# EasyEDA Pro project ProPrj_数控直流电源v3_2025-11-28.epro, board PCB2
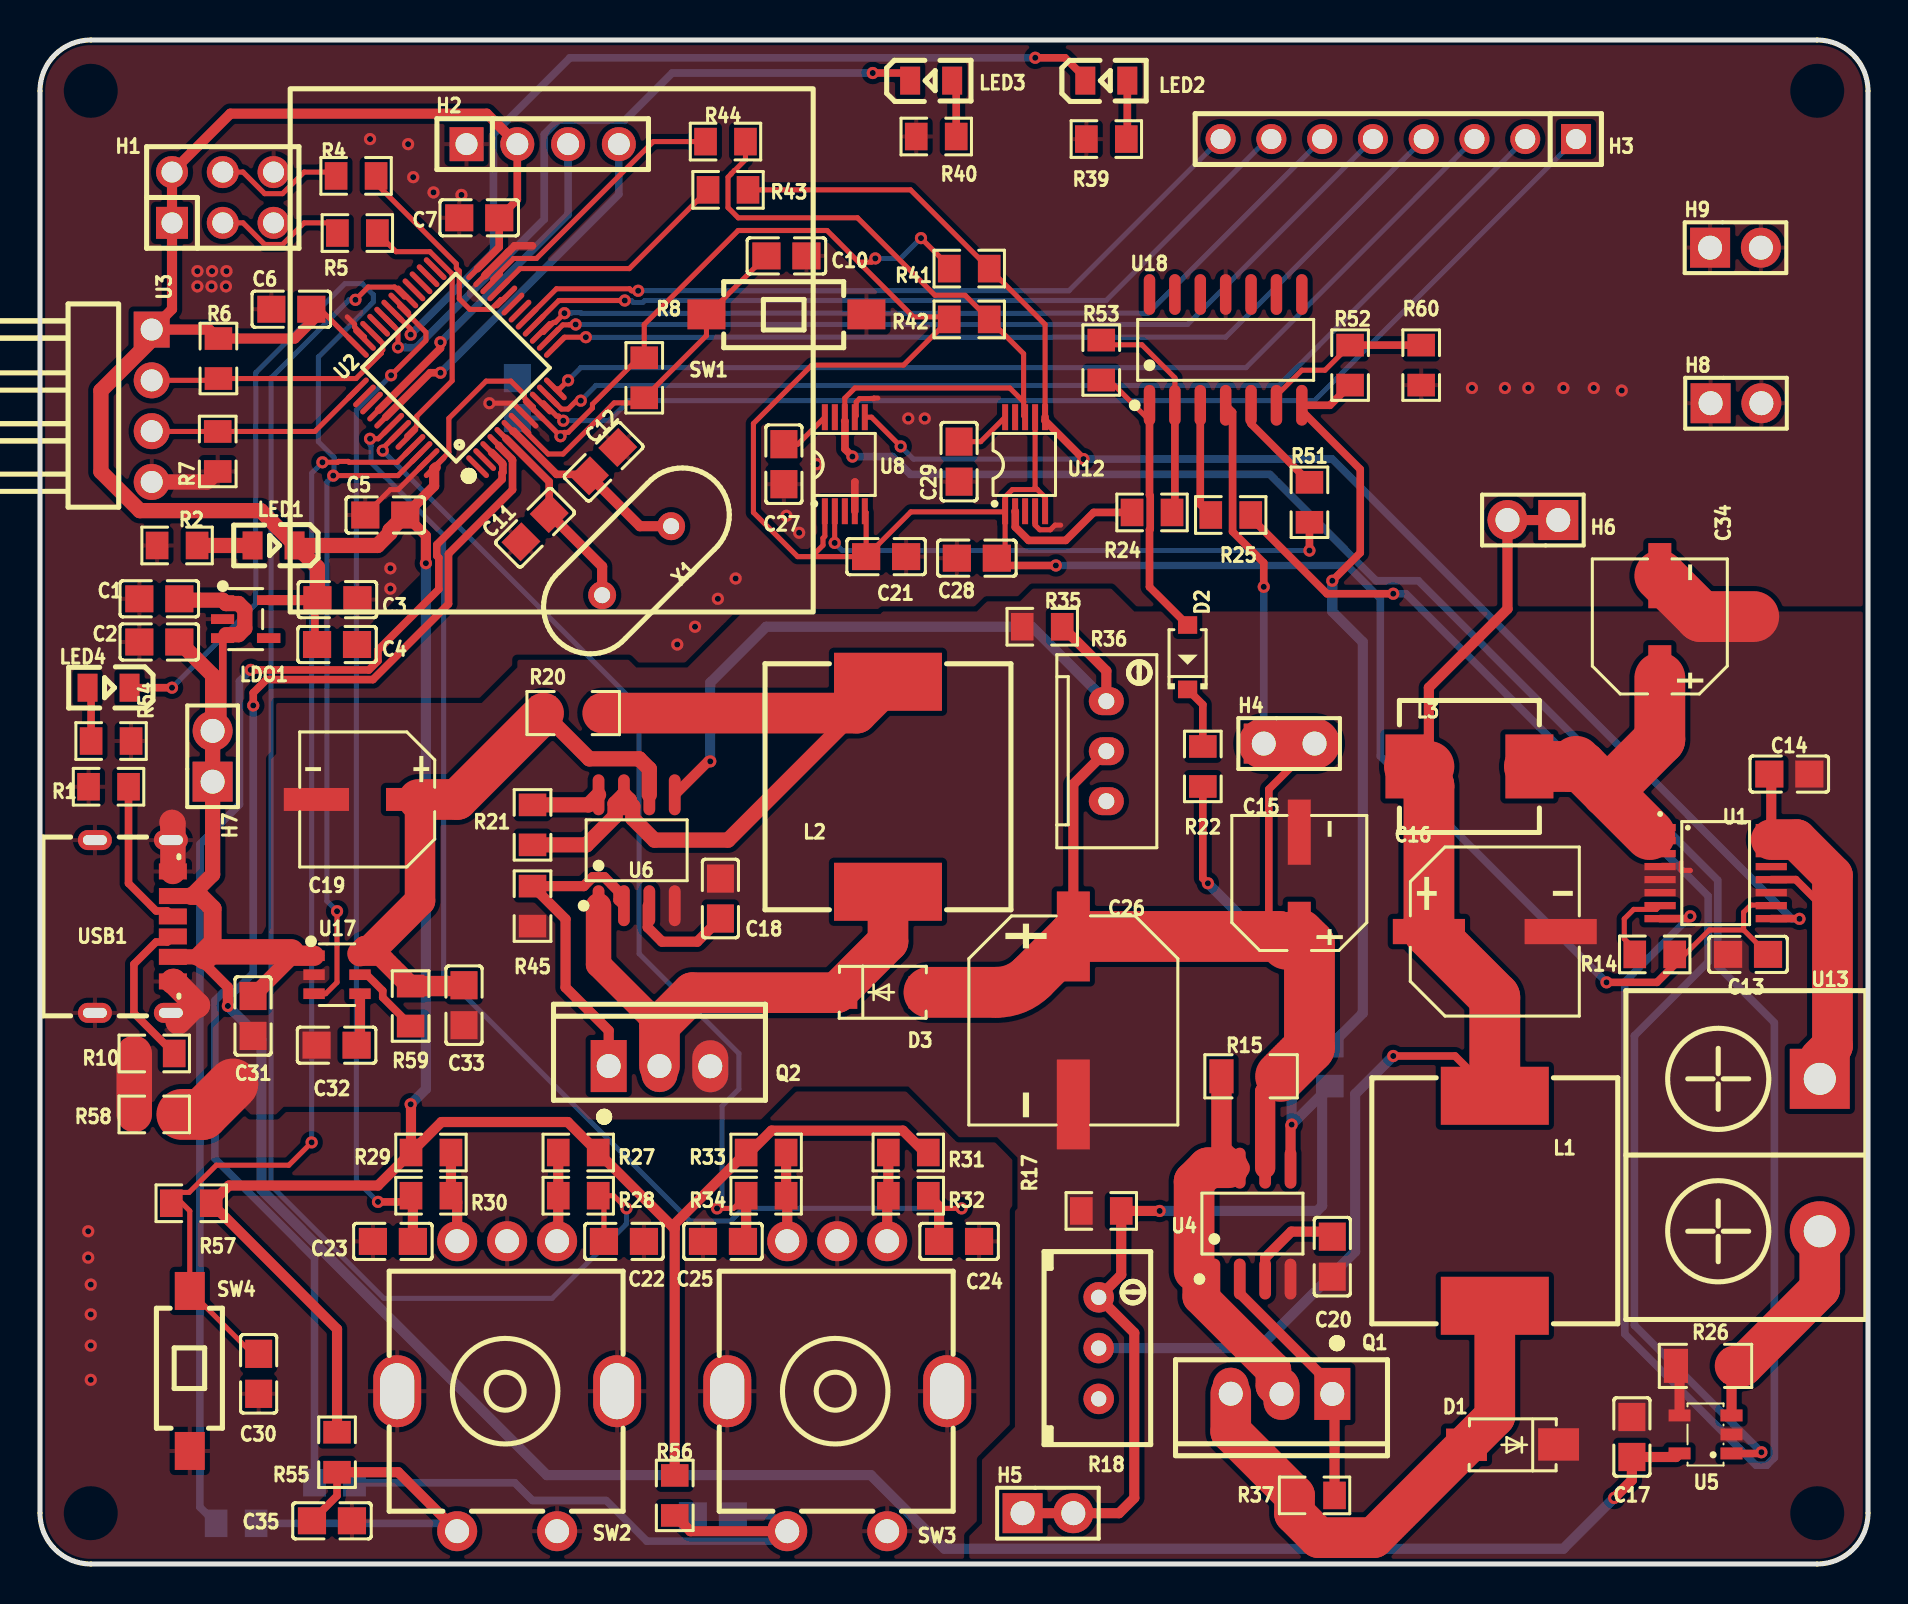
[diagram p3: board, top side]
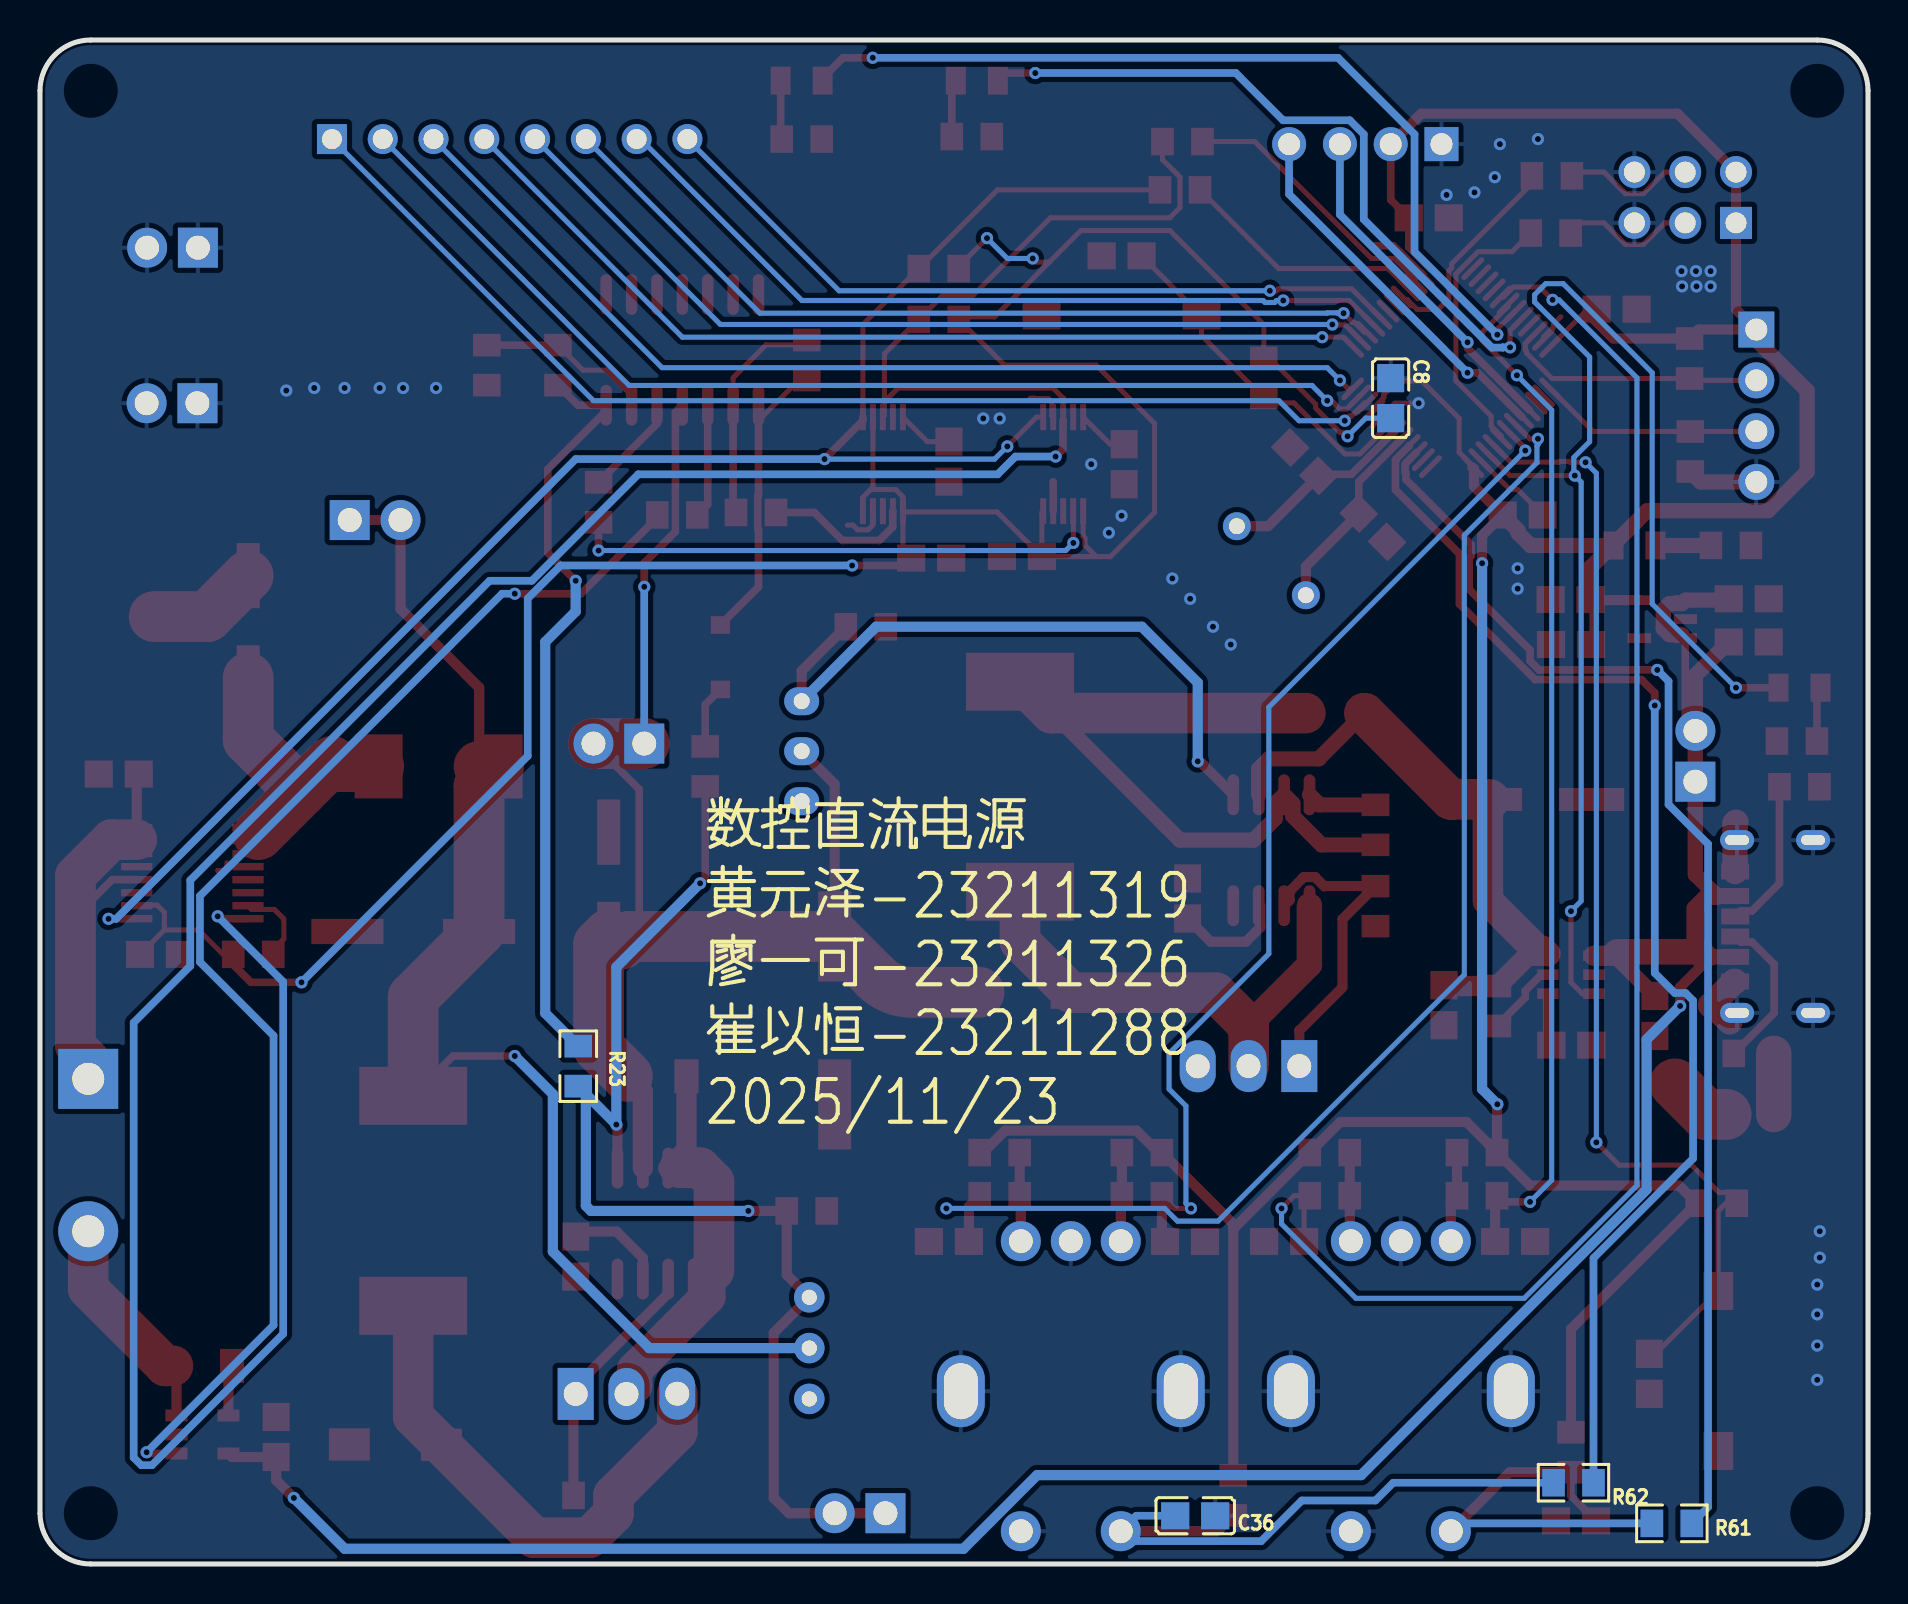
[diagram p4: board, bottom side, seen from below]

Outline 91.44 x 76.2 mm; copper layers: Top Layer, Bottom Layer. Coordinates in mm from the lower left corner of the outline.
Outline path: 0,73.66 0,2.54 arc(0.74,0.74) 2.54,0 88.9,0 arc(90.7,0.74) 91.44,2.54 91.44,73.66 arc(90.7,75.46) 88.9,76.2 2.54,76.2 arc(0.74,75.46) 0,73.66
Stack: Top Layer 0.035mm / Dielectric1 1.51mm FR4 er 4.5 / Bottom Layer 0.035mm

## Design rules (mm)
template: 自定义配置
spacing copperThickness1oz (default): track to track 0.102, other pairs 0.152 to 0.3
spacing copperThickness2oz: track to track 0.203, other pairs 0.152 to 0.3
track width copperThickness1oz (default): min 0.127, default 0.254, max 5.08
track width P: min 0.203, default 0.508, max 5.08
differential pair differentialPair (default): width min 0.127, default 0.254, max 2.54; gap min 0.152, default 0.152
via viaSize (default): diameter min 0.5, default 0.61, max 10; hole min 0.3, default 0.305, max 6.3
net PGND uses PGND

## Placement (name value [footprint] x y rotation side)
C1  100nF  [C0805]  5.97 48.26 0 top
C2  1uF  [C0805]  5.97 46.1 0 top
C3  1uF  [C0805]  14.88 48.22 180 top
C4  100nF  [C0805]  14.86 45.97 180 top
C5  100nF  [C0805]  17.27 52.45 0 top
C6  100nF  [C0805]  12.57 62.74 0 top
C7  100nF  [C0805]  21.97 67.31 0 top
C8  100nF  [C0805]  23.88 58.29 270 bottom
C10  100nF  [C0805]  37.34 65.41 0 top
C11  22pF  [C0805]  24.77 51.82 45 top
C12  22pF  [C0805]  28.19 55.12 225 top
C13  100nF  [C0805]  85.44 30.48 0 top
C14  470nF  [C0805]  87.5 39.5 180 top
C15  100uF  [CAP-SMD_BD6.3-L6.6-W6.6-RD]  62.99 34.04 270 top
C16  470uF  [CAP-SMD_BD8.0-L8.3-W8.3-LS9.0-FD_H10.5]  72.77 31.62 0 top
C17  100nF  [C0805]  79.63 6.35 90 top
C18  1.5nF  [C0805]  34.04 33.27 270 top
C19  100uF  [CAP-SMD_BD6.3-L6.6-W6.6-RD]  16.38 38.23 0 top
C20  470pF  [C0805]  64.64 15.37 90 top
C21  100nF  [C0805]  42.32 50.37 180 top
C22  10nF  [C0805]  29.21 16.13 0 top
C23  10nF  [C0805]  17.65 16.13 0 top
C24  10nF  [C0805]  45.97 16.13 0 top
C25  10nF  [C0805]  34.16 16.13 0 top
C26  330uF  [CAP-SMD_BD10.0-L10.3-W10.3-FD-LS11.0_H12.0]  51.69 27.18 270 top
C27  220nF  [C0805]  37.21 54.99 90 top
C28  100nF  [C0805]  46.86 50.29 0 top
C29  220nF  [C0805]  45.97 55.12 90 top
C30  100nF  [C0805]  10.94 9.51 270 top
C31  1uF  [C0805]  10.66 27.4 90 top
C32  470pF  [C0805]  14.84 25.94 180 top
C33  10uF  [C0805]  21.21 27.94 270 top
C34  100uF  [CAP-SMD_BD6.3-L6.6-W6.6-RD]  81.03 46.86 270 top
C35  10nF  [C0805]  14.61 2.16 0 top
C36  10nF  [C0805]  33.66 2.41 180 bottom
D1  SS34  [SMA_L4.3-W2.6-LS5.0-FD]  73.66 5.97 0 top
D2  1N4148W  [SOD-123_L2.7-W1.6-LS3.7-FD]  57.4 45.34 270 top
D3  SS34  [SMA_L4.3-W2.6-LS5.0-FD]  42.16 28.58 180 top
H1  210-72-03GB01  [HDR-TH_6P-P2.54-V-R2-C3-S2.54_A2541WV-2X3P]  9.14 68.33 0 top
H2  2.54-1*4P母  [HDR-TH_4P-P2.54-V-F]  25.15 70.99 0 top
H3  PZ254V-11-08P  [HDR-TH_8P-P2.54-V-M]  67.94 71.25 180 top
H4  PZ254V-11-02P  [HDR-TH_2P-P2.54-V-M]  62.48 41.02 0 top
H5  PZ254V-11-02P  [HDR-TH_2P-P2.54-V-M]  50.42 2.54 0 top
H6  PZ254V-11-02P  [HDR-TH_2P-P2.54-V-M]  74.68 52.2 180 top
H7  PZ254V-11-02P  [HDR-TH_2P-P2.54-V-M]  8.64 40.39 90 top
H8  PZ254V-11-02P  [HDR-TH_2P-P2.54-V-M]  84.84 58.04 0 top
H9  PZ254V-11-02P  [HDR-TH_2P-P2.54-V-M]  84.81 65.82 0 top
L1  220uH  [IND-SMD_L12.3-W12.3_SMDRI127]  72.77 18.16 270 top
L2  220uH  [IND-SMD_L12.3-W12.3_SMDRI127]  42.42 38.86 90 top
L3  1uH  [IND-SMD_L7.0-W6.6]  71.5 39.88 0 top
LDO1  ME6211C33M5G-N  [SOT-23-5_L3.0-W1.7-P0.95-LS2.8-BL]  10.29 47.24 270 top
LED1  NCD0805B2  [LED0805-R-RD]  11.68 50.93 180 top
LED2  NCD0805B2  [LED0805-R-RD]  53.34 74.17 0 top
LED3  NCD0805B2  [LED0805-R-RD]  44.58 74.17 0 top
LED4  NCD0805B2  [LED0805-R-RD]  3.43 43.81 180 top
Q1  TIP31C  [TO-220-3_L10.0-W4.5-P2.54-L]  62.1 8.51 180 top
Q2  TIP31C  [TO-220-3_L10.0-W4.5-P2.54-L]  30.99 24.89 0 top
R1  5.1kΩ  [R0805]  3.43 38.86 180 top
R2  1kΩ  [R0805]  6.86 50.93 180 top
R4  10kΩ  [R0805]  15.81 69.41 0 top
R5  10kΩ  [R0805]  15.88 66.55 180 top
R6  10kΩ  [R0805]  8.93 60.27 270 top
R7  10kΩ  [R0805]  8.89 55.63 90 top
R8  10kΩ  [R0805]  30.23 59.31 90 top
R10  5.1kΩ  [R0805]  5.72 25.53 180 top
R14  4.7kΩ  [R0805]  80.77 30.48 180 top
R15  220mΩ  [R1206]  60.58 24.38 180 top
R17  10kΩ  [R0805]  53.09 17.65 0 top
R18  100kΩ  [RES-ADJ-TH_3296W]  52.96 10.79 0 top
R20  220mΩ  [R1206]  26.67 42.55 180 top
R21  180Ω  [R0805]  24.64 36.96 270 top
R22  1kΩ  [R0805]  58.17 39.88 90 top
R23  4,7kΩ  [R0805]  64.52 24.89 270 bottom
R24  1kΩ  [R0805]  55.63 52.58 0 top
R25  1kΩ  [R0805]  59.56 52.45 180 top
R26  50mΩ  [R1206]  83.31 9.91 180 top
R27  10kΩ  [R0805]  26.92 20.57 0 top
R28  10kΩ  [R0805]  26.92 18.42 180 top
R29  10kΩ  [R0805]  19.56 20.57 0 top
R30  10kΩ  [R0805]  19.56 18.42 0 top
R31  10kΩ  [R0805]  43.43 20.57 0 top
R32  10kΩ  [R0805]  43.43 18.42 180 top
R33  10kΩ  [R0805]  36.32 20.57 0 top
R34  10kΩ  [R0805]  36.32 18.42 0 top
R35  10kΩ  [R0805]  50.13 46.86 0 top
R36  100kΩ  [RES-ADJ-TH_3296W-1-203]  53.34 40.64 90 top
R37  100Ω  [R0805]  63.75 3.43 0 top
R39  1kΩ  [R0805]  53.34 71.25 180 top
R40  1kΩ  [R0805]  44.83 71.37 180 top
R41  10kΩ  [R0805]  46.48 64.77 0 top
R42  10kΩ  [R0805]  46.48 62.23 0 top
R43  100Ω  [R0805]  34.42 68.71 180 top
R44  100Ω  [R0805]  34.29 71.12 180 top
R45  180Ω  [R0805]  24.64 32.89 270 top
R51  1kΩ  [R0805]  63.5 53.09 90 top
R52  1kΩ  [R0805]  65.53 59.94 270 top
R53  1kΩ  [R0805]  53.09 60.2 270 top
R54  1kΩ  [R0805]  3.56 41.15 0 top
R55  10kΩ  [R0805]  14.86 5.59 90 top
R56  10kΩ  [R0805]  31.75 3.43 270 top
R57  10kΩ  [R0805]  7.57 18.04 0 top
R58  0  [R0805]  5.72 22.48 0 top
R59  180Ω  [R0805]  18.54 27.9 270 top
R60  1kΩ  [R0805]  69.09 59.94 90 top
R61  10kΩ  [R0805]  9.81 2.03 0 bottom
R62  10kΩ  [R0805]  14.73 4.06 0 bottom
SW1  TS-1101-C-W  [SW-SMD_L6.0-W3.3-LS8.0]  37.34 62.48 0 top
SW2  EC11N1525404  [SW-TH_EC11NXXXX]  23.37 8.89 180 top
SW3  EC11N1525404  [SW-TH_EC11NXXXX]  39.88 8.89 180 top
SW4  TS-1101-C-W  [SW-SMD_L6.0-W3.3-LS8.0]  7.49 9.65 270 top
U1  INA260AIPWR  [TSSOP-16_L5.0-W4.4-P0.65-LS6.4-BL-1]  83.82 34.54 270 top
U2  STM32F103C8T6  [LQFP-48_L7.0-W7.0-P0.50-LS9.0-BL]  20.83 59.82 45 top
U3  2541WR-04P  [HDR-TH_4P-P2.54-H-M-W10.4-N]  5.59 57.91 270 top
U4  MC34063ADR  [SOIC-8_L4.9-W3.9-P1.27-LS6.0-BL]  60.65 17.02 0 top
U5  INA180A3IDBVR  [SOT-23-5_L3.0-W1.7-P0.95-LS2.8-BR]  83.31 6.48 0 top
U6  MC34063ADR  [SOIC-8_L4.9-W3.9-P1.27-LS6.0-BL]  29.84 35.69 0 top
U8  DAC60501MDGSR  [VSSOP-10_L3.0-W3.0-P0.50-LS4.9-BL]  40.26 54.99 0 top
U12  DAC60501MDGSR  [VSSOP-10_L3.0-W3.0-P0.50-LS4.9-BL]  49.28 54.99 0 top
U13  KF7.62-2P  [CONN-TH_KF7.62-2P]  89.03 20.45 270 top
U17  TPS22810DBVR  [SOT-23-6_L2.9-W1.6-P0.95-LS2.8-BL]  14.86 29.46 270 top
U18  LM324DT  [SOIC-14_L8.7-W3.9-P1.27-LS6.0-BL]  59.31 60.71 0 top
USB1  UKDBBTAAA  [USB-C-SMD]  4.7 31.88 270 top
X1  8MHz  [CRYSTAL-TH_L11.1-W4.7-P4.88]  29.84 50.17 225 top

## Footprints (pads in the part's own frame, mm; a bottom-side part is the same pattern mirrored in y, then rotated)
C0805
  rect 1.41x1.35 smd: 1(-1,0) 2(1,0)
CAP-SMD_BD6.3-L6.6-W6.6-RD
  rect 3.26x1.15 smd: 1(2.555,0) 2(-2.555,0)
CAP-SMD_BD8.0-L8.3-W8.3-LS9.0-FD_H10.5
  rect 3.61x1.26 smd: 1(-3.295,0) 2(3.295,0)
CAP-SMD_BD10.0-L10.3-W10.3-FD-LS11.0_H12.0
  rect 4.5x1.65 smd: 1(-4.2,0) 2(4.2,0)
CONN-TH_KF7.62-2P
  rect 3x3 hole 1.6: 1(-3.81,0)
  round 3 hole 1.6: 2(3.81,0)
CRYSTAL-TH_L11.1-W4.7-P4.88
  round 1.4 hole 0.8: 1(-2.44,0) 2(2.44,0)
HDR-TH_2P-P2.54-V-M
  rect 2x2 hole 1.2: 1(-1.27,0)
  round 2 hole 1.2: 2(1.27,0)
HDR-TH_4P-P2.54-H-M-W10.4-N
  rect 1.8x1.8 hole 1.1: 1(-3.81,0)
  round 1.8 hole 1.1: 2(-1.27,0) 3(1.27,0) 4(3.81,0)
HDR-TH_4P-P2.54-V-F
  rect 1.7x1.7 hole 1.1: 1(-3.81,0)
  round 1.7 hole 1.1: 2(-1.27,0) 3(1.27,0) 4(3.81,0)
HDR-TH_6P-P2.54-V-R2-C3-S2.54_A2541WV-2X3P
  rect 1.6x1.6 hole 1.05: 1(-2.54,-1.27)
  round 1.6 hole 1.05: 2(-2.54,1.27) 3(0,-1.27) 4(0,1.27) 5(2.54,-1.27) 6(2.54,1.27)
HDR-TH_8P-P2.54-V-M
  rect 1.5x1.5 hole 1: 1(-8.89,0)
  round 1.5 hole 1: 2(-6.35,0) 3(-3.81,0) 4(-1.27,0) 5(1.27,0) 6(3.81,0) 7(6.35,0) 8(8.89,0)
IND-SMD_L7.0-W6.6
  rect 2.4x3.2 smd: 1(-3,0) 2(3,0)
IND-SMD_L12.3-W12.3_SMDRI127
  rect 2.9x5.4 smd: 1(-5.25,0) 2(5.25,0)
LED0805-R-RD
  rect 1x1.399 smd: 1(1.05,0) 2(-1.05,0)
LQFP-48_L7.0-W7.0-P0.50-LS9.0-BL
  oval 0.27x1.5 smd: 1(-2.75,-4.25) 2(-2.25,-4.25) 3(-1.75,-4.25) 4(-1.25,-4.25) 5(-0.75,-4.25) 6(-0.25,-4.25) 7(0.25,-4.25) 8(0.75,-4.25) 9(1.25,-4.25) 10(1.75,-4.25) 11(2.25,-4.25) 12(2.75,-4.25) 25(2.75,4.25) 26(2.25,4.25) 27(1.75,4.25) 28(1.25,4.25) 29(0.75,4.25) 30(0.25,4.25) 31(-0.25,4.25) 32(-0.75,4.25) 33(-1.25,4.25) 34(-1.75,4.25) 35(-2.25,4.25) 36(-2.75,4.25)
  oval 1.5x0.27 smd: 13(4.25,-2.75) 14(4.25,-2.25) 15(4.25,-1.75) 16(4.25,-1.25) 17(4.25,-0.75) 18(4.25,-0.25) 19(4.25,0.25) 20(4.25,0.75) 21(4.25,1.25) 22(4.25,1.75) 23(4.25,2.25) 24(4.25,2.75) 37(-4.25,2.75) 38(-4.25,2.25) 39(-4.25,1.75) 40(-4.25,1.25) 41(-4.25,0.75) 42(-4.25,0.25) 43(-4.25,-0.25) 44(-4.25,-0.75) 45(-4.25,-1.25) 46(-4.25,-1.75) 47(-4.25,-2.25) 48(-4.25,-2.75)
R0805
  rect 1.133x1.377 smd: 1(-1,0) 2(1,0)
R1206
  rect 1.208x1.701 smd: 1(-1.479,0) 2(1.479,0)
RES-ADJ-TH_3296W
  round 1.524 hole 0.762: 1(0,2.54) 2(0,0) 3(0,-2.54)
RES-ADJ-TH_3296W-1-203
  oval 1.4x1.75 hole 0.8: 1(-2.5,0) 2(0,0) 3(2.5,0)
SMA_L4.3-W2.6-LS5.0-FD
  rect 2.046x1.62 smd: 1(-2.304,-0.009) 2(2.304,0.009)
SOD-123_L2.7-W1.6-LS3.7-FD
  rect 0.88x0.96 smd: 1(-1.61,0) 2(1.61,0)
SOIC-8_L4.9-W3.9-P1.27-LS6.0-BL
  oval 0.588x2.045 smd: 1(-1.905,-2.772) 2(-0.635,-2.772) 3(0.635,-2.772) 4(1.905,-2.772) 5(1.905,2.772) 6(0.635,2.772) 7(-0.635,2.772) 8(-1.905,2.772)
SOIC-14_L8.7-W3.9-P1.27-LS6.0-BL
  oval 0.574x2.038 smd: 1(-3.81,-2.769) 2(-2.54,-2.769) 3(-1.27,-2.769) 4(0,-2.769) 5(1.27,-2.769) 6(2.54,-2.769) 7(3.81,-2.769) 8(3.81,2.769) 9(2.54,2.769) 10(1.27,2.769) 11(0,2.769) 12(-1.27,2.769) 13(-2.54,2.769) 14(-3.81,2.769)
SOT-23-5_L3.0-W1.7-P0.95-LS2.8-BL
  rect 0.49x1.157 smd: 1(-0.95,-1.153) 2(0,-1.153) 3(0.95,-1.153)
  rect 0.49x1.175 smd: 4(0.95,1.153) 5(-0.95,1.153)
SOT-23-5_L3.0-W1.7-P0.95-LS2.8-BR
  rect 1.1x0.6 smd: 1(1.3,-0.95) 2(1.3,0) 3(1.3,0.95) 4(-1.3,0.95) 5(-1.3,-0.95)
SOT-23-6_L2.9-W1.6-P0.95-LS2.8-BL
  rect 0.532x1.072 smd: 1(-0.95,-1.149) 2(0,-1.149) 3(0.95,-1.149) 4(0.95,1.149) 5(0,1.149) 6(-0.95,1.149)
SW-SMD_L6.0-W3.3-LS8.0
  rect 1.9x1.5 smd: 1(-4,0) 2(4,0)
SW-TH_EC11NXXXX
  round 2 hole 1.2: A(-2.5,-7.25) B(2.5,-7.25) C(0,-7.25) D(-2.5,7.25) E(2.5,7.25)
  oval 2.4x3.6 hole 1.7x2.8: EH(-5.5,0.25) EH(5.5,0.25)
TO-220-3_L10.0-W4.5-P2.54-L
  rect 1.8x2.6 hole 1.2: 1(-2.54,0.005)
  oval 1.8x2.6 hole 1.2: 2(0,0.005) 3(2.54,-0.005)
TSSOP-16_L5.0-W4.4-P0.65-LS6.4-BL-1
  rect 0.364x1.56 smd: 1(-2.275,-2.78) 2(-1.625,-2.78) 3(-0.975,-2.78) 4(-0.325,-2.78) 5(0.325,-2.78) 6(0.975,-2.78) 7(1.625,-2.78) 8(2.275,-2.78) 9(2.275,2.78) 10(1.625,2.78) 11(0.975,2.78) 12(0.325,2.78) 13(-0.325,2.78) 14(-0.975,2.78) 15(-1.625,2.78) 16(-2.275,2.78)
USB-C-SMD
  oval 1x1.7 hole 0.5x1.2: 1(-4.32,1.849) 2(-4.32,-1.951) 3(4.32,-1.951) 4(4.32,1.849)
  rect 0.8x1.4 smd: A5(-0.5,1.947) A9(1.52,1.948) A12(2.75,1.949) B5(0.5,1.947) B9(-1.52,1.951) B12(-2.75,1.949)
VSSOP-10_L3.0-W3.0-P0.50-LS4.9-BL
  rect 0.3x1.3 smd: 1(-1,-2.35) 2(-0.5,-2.35) 3(0,-2.35) 4(0.5,-2.35) 5(1,-2.35) 6(1,2.35) 7(0.5,2.35) 8(0,2.35) 9(-0.5,2.35) 10(-1,2.35)

## Nets
As in the schematic.

Pads without a net: LDO1 4; R18 3; R36 1; U1 13; U8 3 9; U12 3 9; U18 8 9 10 12 13 14

## Via types
v1: diameter 0.61, hole 0.305, Top Layer to Bottom Layer, 89 vias

## Routing (per net, layer and track width the routed paths; a pad name or vN(x,y) marks a point on that pad's centre or on a via; arc(x,y) is an arc through that point)
+5V: length 132.7
  Top Layer w0.381: H7.2 9.14,42.16 9.14,46.29
  Top Layer w0.508: 7.88,30.36 9.4,28.84 v1(9.4,27.9) ; U5.5 81.84,5.35 C17.1 79.63,4.19 v1(78.74,3.3)
  Top Layer w0.762: USB1.B9 7.56,33.4 8.64,34.47 H7.1 H7.2 8.64,44.43 C2.2 ; C31.2 12.67,30.41 ; 9.31,46.47 9.93,46.47 10.25,46.78 10.25,47.71 9.93,48.02 9.31,48.02 LDO1.1 7.03,48.19 C1.2 ; USB1.A9 7.88,30.36
  Top Layer w0.889: 7.88,30.36 8.64,31.11 8.64,32.77 8,33.4 7.56,33.4
  Top Layer w1.016: 12.67,30.41 U17.1
  Top Layer w1.27: 12.57,30.61 8.51,30.61 8.25,30.35
  Bottom Layer w0.508: v1(9.4,27.9) 11.07,26.23 11.07,18.72 25.35,4.44 41.56,4.44 45.24,0.76 76.2,0.76 v1(78.74,3.3)
+5V-SWITCH: length 30.8
  Top Layer w0.762: R20.2 27.48,40.26 29.97,40.26 30.48,39.75 U6.6
  Top Layer w1.016: C33.1 21.17,28.9 R59.1 17.02,30.41 U17.6
  Top Layer w1.27: 16.01,30.52 16.26,30.77 16.62,30.77
  Top Layer w1.524: C19.1 19.01,38.16 19.01,33.16 16.62,30.77
  Top Layer w2.032: R20.2 20.87,38.23 C19.1
GND: length 28.8
  Top Layer w0.254: C5.1 16.27,52.47 17.53,53.72 17.91,53.72 U2.47 ; v1(22.48,58.04) 23.67,58.04 U2.8 ; U12.4 49.78,51.95 50.01,51.71 50.54,51.71 50.77,51.94 51.05,51.94 ; 15.37,62.36 15.74,61.99 15.74,61.85 16.23,61.35 U2.35 ; U8.7 40.83,57.41 40.83,58.11 40.99,58.27 41.69,58.27 41.71,58.29 41.91,58.29
  Top Layer w0.381: 24.64,65.91 23.74,65.91 23.45,65.62 arc(23.42,65.6) 23.4,65.57 22.34,64.52 arc(22.32,64.5) 22.3,64.47 22.24,64.41 ; 40.77,54.1 40.76,54.09 U8.4
  Top Layer w0.762: U3.4 8.37,54.1 R7.1
  Top Layer w1.27: 6.91,27.11 7.75,27.94 7.87,27.94 6.69,29.13 USB1.A12 ; 6.65,36.1 USB1.1 ; 6.65,36.1 USB1.B12 ; 6.65,36.1 6.65,37.04 6.6,37.08
  Top Layer w1.778: R58.1 R10.2
  vias: v1(2.41,16.64) v1(2.41,15.32) v1(2.54,13.97) v1(2.54,12.48) v1(2.54,10.92) v1(2.54,9.21) v1(7.87,64.64) v1(7.87,63.88) v1(8.61,64.64) v1(8.58,63.88) v1(9.33,64.64) v1(9.3,63.88) v1(16.51,71.25) v1(17.53,49.78) v1(17.53,48.77) v1(18.42,70.99) v1(18.67,69.34) v1(19.69,68.58) v1(21.08,68.45) v1(31.88,45.97) v1(32.77,46.86) v1(33.91,48.26) v1(34.8,49.28) v1(37.34,52.41) v1(37.97,51.56) v1(38.86,54.99) v1(43.43,57.28) v1(44.26,57.28) v1(71.63,58.8) v1(73.28,58.8) v1(74.45,58.8) v1(76.2,58.8) v1(77.72,58.8) v1(79.12,58.67)
PGND: length 12.1
  Top Layer w0.254: 82.1,35.06 82.1,34.68 82.54,34.68 82.55,34.67
  Top Layer w0.508: R26.2 82.01,9.73 U5.4
  Top Layer w2.54: 7.1,22.48 8.13,22.48 9.65,24 ; 85.72,47.37 83.07,47.37 C34.2
VCC: length 330.7
  Top Layer w0.254: 40.95,65.09 39.37,66.67 34.93,66.67 30.23,61.98 R8.2 29.96,60.31 27.64,57.99 27.64,57.8 26.42,56.58 26.23,56.58 v1(26.03,56.39) 24.73,57.7 ; 40.95,65.09 41.6,65.09 v1(41.78,65.28) ; 40.95,65.09 43.69,62.36 45.35,62.36 R42.1 43.2,59.94 38.61,59.94 35.69,57.02 35.69,52.58 37.9,50.37 38.6,50.37 ; 49.89,53.72 50.29,53.32 50.29,52.66 U12.5 ; 49.89,53.72 49.78,53.84 U12.7 ; 49.89,53.72 48.64,53.72 48.28,53.36 U12.1 ; C6.2 14.02,62.74 U2.36 ; 82.15,30.35 83.5,31.7 85.22,31.7 ; 85.22,31.7 85.22,32.59 85.58,32.95 86.57,32.95 U1.10 ; 85.22,31.7 C13.2 ; 24.69,57.7 24.69,57.85 24.22,58.31 24.22,58.48 23.56,59.14 22.31,59.14 20.45,57.28 20.45,55.58 19.89,55.03 19.89,54.99 ; U8.1 39.26,51.39 39.17,51.3 39.17,50.94 38.6,50.37 ; C21.2 38.6,50.37 ; C21.2 41.32,52.58 U8.5 ; C21.2 43.56,52.61 48.24,52.61 U12.1 ; v1(44.07,66.29) 45.48,64.88 R41.1 ; U12.1 48.28,50.7 C28.2
  Top Layer w0.381: v1(78.36,29.08) 80.88,29.08 82.15,30.35 ; H2.2 23.88,68.22 C7.2 22.97,65.85 U2.24 ; v1(50.82,49.93) 48.23,49.93 C28.2 ; 13.75,48.19 13.75,46.25 13.73,46.23
  Top Layer w0.508: 19.8,54.84 19.72,54.76 19.72,53.9 C5.2 19.3,51.42 v1(19.3,50.04) ; R56.1 31.75,16.78 ; 31.75,16.78 31.72,16.78 R27.2 26.4,22.1 20.08,22.1 R29.1 ; 31.75,16.78 31.75,17 R33.1 35.49,20.57 36.59,21.67 43.17,21.67 44.26,20.57 R31.2 ; R55.2 14.86,11.75 R57.2 9.45,18.92 16.91,18.92 R29.1 ; R29.1 18.56,22.97 v1(18.54,22.99) ; 13.96,62.49 12.75,61.27 R6.1 8.48,61.72 U3.1 6.6,62.74 H1.1 H1.2 9.53,72.52 22.35,72.52 H2.2 ; LDO1.5 13.75,48.19
  Top Layer w0.762: C5.2 17.51,51.69 17.51,51.56 16.88,50.93 12.78,50.93 ; 12.78,50.93 13.88,49.83 C3.2 ; 12.78,50.93 11.04,52.67 4.99,52.67 3.05,54.62 3.05,58.67 5.59,61.21 U3.1
  Bottom Layer w0.254: v1(44.07,66.29) 43.05,65.28 v1(41.78,65.28) ; C8.2 25.13,57.29 v1(26.03,56.39)
  Bottom Layer w0.381: v1(50.82,49.93) 65.39,49.93 67.04,48.27 67.04,40.4 v1(78.36,29.08)
  Bottom Layer w0.508: v1(19.3,50.04) 19.3,23.75 v1(18.54,22.99)
BOOT0: length 13.7
  Top Layer w0.254: R5.1 17.81,65.62 19.5,65.62 20.62,64.5 20.62,59.16 18.85,57.39 18.85,56.9 18.35,56.4 18.35,56.28
BOOT1: length 10.8
  Top Layer w0.254: R4.2 16.68,69.28 16.68,69.15 20.83,65.01 20.83,64.8 20.97,64.65 20.97,63.26 21.5,62.73 22.56,62.73 23.05,63.23 23.18,63.23 23.3,63.35
DAC-IOUT: length 7.5
  Top Layer w0.381: R24.1 52.71,52.58 51.31,51.18 49.45,51.18 48.78,51.85 48.78,52.63 U12.2
DAC-VOUT: length 26.9
  Top Layer w0.254: v1(39.75,51.05) 39.75,52.63 U8.2
  Top Layer w0.381: R51.1 v1(63.5,50.67)
  Bottom Layer w0.254: v1(39.75,51.05) 40.13,50.67 v1(63.5,50.67)
DAC-VOUT1: length 38
  Top Layer w0.381: R52.2 64.53,57.94 U18.7 63.12,57.66 66.04,54.74 66.04,50.56 v1(64.64,49.16)
  Bottom Layer w0.508: v1(64.64,49.16) 64.64,47.62 66.17,46.1 66.17,27.54 R23.1
I-FB: length 60.9
  Top Layer w0.381: R22.1 58.17,34.29 v1(58.42,34.04)
  Top Layer w0.508: H5.1 53.97,2.54 54.74,3.3 54.74,11.56 R18.1 54.09,14.46 R17.2 v1(56.01,17.65) ; v1(62.61,21.97) 62.55,21.91 U4.5
  Bottom Layer w0.508: 64.13,23.5 64.13,17.91 63.88,17.65 v1(56.01,17.65) ; 64.13,23.5 64.13,23.51 R23.2 ; 64.13,23.5 v1(62.61,21.97) 62.61,29.84 v1(58.42,34.04)
I-VOUT: length 64.3
  Top Layer w0.381: v1(86.11,5.59) 86.04,5.53 U5.1 ; R25.1 60.56,52.33 64.38,48.51 v1(67.69,48.51)
  Bottom Layer w0.381: v1(86.11,5.59) 79.76,11.94 79.76,26.42 83.44,30.1 83.44,33.4 68.33,48.51 v1(67.69,48.51)
IN-: length 19.5
  Top Layer w0.254: U1.16 U1.15
  Top Layer w0.381: U1.12 87.83,34.22 89.03,33.02
  Top Layer w0.508: U1.16 86.6,39.4 C14.2
  Top Layer w2.032: 86.6,36.22 87.86,36.22 89.66,34.42 89.66,25.91 89.03,25.27
OSCIN: length 9.8
  Top Layer w0.381: C11.2 25.47,54.11 23.3,56.28
  Top Layer w0.508: X1.2 28.12,49.88 C11.2
OSCOUT: length 9.9
  Top Layer w0.381: 27.49,54.41 27.42,54.48 25.84,54.48 23.69,56.64 U2.6
  Top Layer w0.508: X1.1 30.01,51.89 27.49,54.41
PA0: length 58
  Top Layer w0.254: U2.10 25.19,58.05 25.85,57.39 25.95,57.39 v1(26.18,57.16)
  Bottom Layer w0.254: 76.84,71.25 63.75,58.17 29.46,58.17 28.46,57.16 v1(26.18,57.16)
PA1: length 54.7
  Top Layer w0.254: 25.42,58.4 26.08,57.75 26.42,57.75 26.84,58.17 v1(27.05,58.17)
  Bottom Layer w0.254: v1(27.05,58.17) 27.81,58.93 61.98,58.93 H3.2
PA2: length 51.2
  Top Layer w0.254: v1(26.42,59.18) 25.99,58.76 U2.12
  Bottom Layer w0.254: H3.3 60.32,59.82 27.05,59.82 v1(26.42,59.18)
PA3: length 47.7
  Top Layer w0.254: U2.13 26.24,61.34 v1(27.31,61.34)
  Bottom Layer w0.254: v1(27.31,61.34) 59.31,61.34 H3.4
PA4: length 45.4
  Top Layer w0.254: v1(26.8,61.98) 26.5,61.98 26.47,61.96 26.15,61.96 25.92,61.72 25.92,61.72 U2.14
  Bottom Layer w0.254: v1(26.8,61.98) 57.4,61.98 66.68,71.25
PA5: length 43.1
  Top Layer w0.254: U2.15 25.19,61.58 25.69,62.08 25.77,62.08 v1(26.23,62.54)
  Bottom Layer w0.254: v1(26.23,62.54) 26.53,62.54 26.56,62.56 27.04,62.56 27.06,62.54 55.43,62.54 H3.6
PA6: length 40.8
  Top Layer w0.254: 24.72,61.94 25.95,63.17 v1(29.25,63.17)
  Bottom Layer w0.254: v1(29.25,63.17) 29.58,63.17 29.68,63.08 30.16,63.08 30.26,63.17 53.33,63.17 61.4,71.25 H3.7
PA7: length 38.5
  Top Layer w0.254: U2.17 25.83,63.76 29.49,63.76 29.59,63.66 v1(29.92,63.66)
  Bottom Layer w0.254: v1(29.92,63.66) 51.47,63.66 H3.8
PA8: length 75.8
  Top Layer w0.254: C22.1 28.21,18.13 R28.1 28.7,18.42 v1(29.34,17.78) ; v1(15.78,63.21) 16.42,63.85 17.74,63.85 18.23,63.35 18.35,63.35
  Bottom Layer w0.254: v1(29.34,17.78) 29.34,17.01 25.61,13.28 17.2,13.28 11.56,18.92 11.56,59.31 15.46,63.21 v1(15.78,63.21)
PA9: length 51.4
  Top Layer w0.254: 18,63 18,62.89 19.3,61.58 19.3,61.18 v1(17.56,59.44)
  Top Layer w0.381: v1(16.91,18.11) 18.25,18.11 R30.1
  Top Layer w0.508: C23.2 18.65,18.32 R30.1
  Bottom Layer w0.254: v1(16.91,18.11) 15.82,19.19 15.82,57.7 v1(17.56,59.44)
PA10: length 44.9
  Top Layer w0.254: U2.31 18.54,61.75 v1(18.54,61.47)
  Top Layer w0.381: v1(49.78,75.31) 51.27,75.31 52.29,74.3
  Bottom Layer w0.381: v1(49.78,75.31) 26.51,75.31 22.68,71.49 22.68,65.61 v1(18.54,61.47)
PA11: length 35.7
  Top Layer w0.254: U2.32 17.91,61.68 v1(17.91,60.83)
  Top Layer w0.381: LED3.2 43.15,74.55 v1(41.66,74.55)
  Bottom Layer w0.381: v1(41.66,74.55) 31.62,74.55 29.26,72.19 25.92,72.19 25.22,71.49 25.22,67.23 18.81,60.82 18.27,60.82 18.26,60.83 v1(17.91,60.83)
PB4: length 17.2
  Top Layer w0.381: 16.94,57.7 20.03,60.79 v1(20.03,61.09)
  Bottom Layer w0.381: H2.3 26.42,67.47 v1(20.03,61.09)
PB5: length 18.8
  Top Layer w0.381: v1(20.03,59.56) 19.51,59.56 U2.41
  Bottom Layer w0.381: H2.4 28.96,68.49 v1(20.03,59.56)
PB6: length 64.7
  Top Layer w0.254: 44.97,17.88 45.07,17.78 v1(46.1,17.78) ; U2.42 16.92,56.26 v1(16.51,56.26)
  Top Layer w0.508: R32.1 44.97,17.88 C24.1
  Bottom Layer w0.254: v1(46.1,17.78) 35.18,17.78 34.54,17.14 32.51,17.14 20.19,29.46 20.19,51.44 16.56,55.07 16.56,55.91 16.51,55.96 v1(16.51,56.26)
PB7: length 51.1
  Top Layer w0.254: U2.43 17.14,55.78 v1(17.14,55.67) ; v1(33.87,17.78) 34.69,17.78 R34.1
  Top Layer w0.508: R34.1 35.32,16.29 C25.2
  Bottom Layer w0.254: v1(17.14,55.67) 29.97,42.84 29.97,30.51 34.96,25.52 34.96,23.74 34.12,22.9 34.12,18.03 v1(33.87,17.78)
PB8: length 57.8
  Top Layer w0.254: 6.57,18.58 7.49,17.65 SW4.1 10.64,10.51 C30.1 ; 6.57,18.58 R57.1 ; 6.57,18.58 7.46,18.58 8.82,19.94 12.45,19.94 v1(13.59,21.08) ; v1(14.13,55.09) 14.89,55.09 14.93,55.13 15.42,55.13 15.46,55.09 17.86,55.09 U2.45
  Bottom Layer w0.254: v1(14.13,55.09) 13.59,54.54 v1(13.59,21.08)
PB9: length 70
  Top Layer w0.254: v1(14.86,32.64) 14.86,29.08 14.29,28.51 U17.3 ; v1(14.67,54.42) 17.91,54.42 U2.46
  Top Layer w0.381: LED4.2 v1(6.6,43.81)
  Bottom Layer w0.254: v1(14.86,32.64) 14.35,33.15 14.35,54.1 v1(14.67,54.42) 14.71,54.46 14.71,55.33 13.93,56.12 13.93,60.35 16.68,63.1 16.68,63.46 16.12,64.02 15.25,64.02 10.8,59.56 10.8,48.01 v1(6.6,43.81)
PB10: length 12.5
  Top Layer w0.254: U2.21 24.01,64.77 29.48,64.77 R43.2
PB11: length 13.5
  Top Layer w0.254: 22.64,64.23 23.69,65.28 24.84,65.28 30.68,71.12 R44.2
PC14: length 63.9
  Top Layer w0.381: v1(10.54,44.7) 16.45,44.7 16.91,45.16 16.91,45.7 19.95,48.74 19.95,50.31 19.85,50.41 19.85,50.97 23.11,54.23 23.11,54.55 23.15,54.59 23.15,54.98 23.11,55.02 23.11,55.06 U2.3
  Bottom Layer w0.381: v1(10.54,44.7) 9.98,44.14 9.98,37.97 8,36 8,2.84 R61.1
PC15: length 63.8
  Top Layer w0.381: U2.4 22.95,55.9 23.6,55.26 23.6,55.22 23.64,55.18 23.64,53.71 20.43,50.51 20.43,48 16.65,44.22 11.33,44.22 10.67,43.56 v1(10.67,42.93)
  Bottom Layer w0.381: R62.1 13.73,15.29 8.75,20.27 8.75,28.17 9.13,28.55 9.67,28.55 10.67,29.55 v1(10.67,42.93)
QOD: length 3.8
  Top Layer w0.381: U17.5 16.34,29.46 17.14,28.66 17.14,28.33 18.54,26.93 R59.2
RESET: length 17.4
  Top Layer w0.254: 24.2,56.71 25.42,55.5 26.16,55.5 28.72,58.06 29.97,58.06 R8.1 33.34,61.42 SW1.1 33.42,62.48 C10.1
RS+: length 11
  Top Layer w0.508: U5.3 84.61,9.73
  Top Layer w2.032: U13.2 89.03,13.76 85.17,9.91 R26.1
SCL2: length 83.7
  Top Layer w0.254: v1(43.05,55.88) 41.59,57.34 U8.6 ; U12.6 50.28,61.98 R41.2 43.54,68.71 R43.1
  Top Layer w0.381: U1.9 88,32.27 v1(88.01,32.26) ; v1(52.2,55.25) 50.28,57.17 U12.6
  Bottom Layer w0.254: v1(52.2,55.25) 43.69,55.25 v1(43.05,55.88)
  Bottom Layer w0.381: v1(52.2,55.25) 64.64,55.25 87.63,32.26 v1(88.01,32.26)
SDA2: length 153.3
  Top Layer w0.254: 49.2,58.11 49.21,58.11 49.21,57.41 U12.8 ; 49.2,58.11 48.51,58.8 40.77,58.8 40.26,58.29 U8.8 ; 49.2,58.11 49.2,60.51 R42.2 46.28,63.44 44.77,63.44 40.89,67.31 34.93,67.31 34.42,67.82 34.42,69.34 34.57,69.5 34.57,69.51 34.74,69.67 34.75,69.67 35.29,70.22 R44.1
  Top Layer w0.381: v1(40.64,55.37) 40.27,55.75 40.27,57.14 40.25,57.15 ; v1(82.55,32.39) 82.43,32.27 U1.8
  Bottom Layer w0.381: v1(82.55,32.39) 79.27,29.11 79.27,11.51 85.84,4.94 86.37,4.94 86.75,5.32 86.75,27.07 83.92,29.9 83.92,34.19 68.95,49.16 66.84,49.16 61.52,54.48 43.53,54.48 42.65,55.37 v1(40.64,55.37)
STEP-DOWN1: length 19.2
  Top Layer w1.016: U4.7 59.1,20.71 R15.2
  Top Layer w1.778: Q1.2 61.7,8.91 61.7,9.7 58.04,13.36 58.04,14.61
  Top Layer w2.032: 57.73,14.66 57.73,19.12 58.42,19.81 59.44,19.81
SWCLK: length 11.2
  Top Layer w0.254: U2.37 13.75,56.63 R7.2 5.6,56.63 U3.3
SWDIO: length 13.4
  Top Layer w0.254: U2.34 17.14,61.03 17.14,60.71 17.08,60.64 17.08,60.54 15.81,59.27 R6.2 8.83,59.18 U3.2
V-UP: length 72
  Top Layer w0.381: v1(61.21,48.86) 61.21,50.06 59.65,51.62 59.65,57.59 U18.4 ; H4.2 61.47,38.73 61.47,31.88
  Top Layer w0.508: R36.2 51.69,38.99 C26.1
  Top Layer w1.016: U4.6 61.28,23.61 R15.1
  Top Layer w2.54: C15.1 63.5,30.97 63.5,25.83 R15.1 ; H4.2 H4.1 ; 62.36,30.99 61.97,31.38 C26.1 49.64,29.33 arc(48.82,28.78) 47.84,28.58 D3.1
  Bottom Layer w0.381: H4.1 61.21,48.64
VOUT: length 66
  Top Layer w0.381: v1(67.69,25.4) 70.78,25.4 L1.1
  Top Layer w0.508: H6.1 H6.2 73.41,47.75 69.47,43.82 69.47,39.88
  Top Layer w2.54: L1.1 72.77,28.33 C16.1 69.48,38.9 L3.1 ; 69.48,39.88 69.47,39.88
  Bottom Layer w0.508: R18.2 60.96,10.79 65.79,15.62 65.79,23.5 v1(67.69,25.4)
VOUT-FILTER: length 14.6
  Top Layer w2.54: 78.39,38.6 80.52,36.47 ; 78.39,38.6 81.03,41.23 C34.1 ; 78.39,38.6 77.11,39.88 76.58,39.88 ; 76.58,39.88 76.84,40.13 ; 76.58,39.88 L3.2
$1N3381: length 7.7
  Top Layer w0.381: R1.1 4.43,34.03 5.81,32.65 6.37,32.65 USB1.A5
$1N3384: length 7.8
  Top Layer w0.381: USB1.B5 6.37,31.1 5.81,31.1 4.7,29.99 4.7,27.54 R10.1
$1N3407: length 2.7
  Top Layer w0.762: 10.58,50.93 R2.1
$1N3468: length 6.6
  Top Layer w0.254: H1.4 10.16,69.6 11.24,68.52 12.13,68.52 13.21,69.6 14.62,69.6 R4.1
$1N3483: length 6.8
  Top Layer w0.254: H1.3 10.16,67.06 11.24,65.98 12.13,65.98 13.21,67.06 14.37,67.06 R5.2
$1N3763: length 4.3
  Top Layer w0.254: U1.7 80.85,32.73 79.72,32.73 79.25,32.26 79.25,31.26 80.15,30.35
$1N5169: length 25.9
  Top Layer w2.032: L1.2 72.77,7.37 D1.1 66.71,1.32 63.96,1.32 62.75,2.52 R37.1 59.56,6.62 Q1.3
$1N12640: length 3.5
  Top Layer w0.762: U6.8 27.44,37.96 R21.1
$1N14143: length 5.1
  Top Layer w0.508: U4.3 61.28,15.31 62.59,16.62 64.77,16.62
$1N14411: length 14.3
  Top Layer w0.254: 55.5,57.17 53.48,59.2 R53.2
  Top Layer w0.381: 55.5,57.17 55.5,53.44 55.53,53.41 55.53,51.75 55.5,51.71 55.5,48.85 D2.1
$1N14439: length 3.2
  Top Layer w0.381: R22.2 58.17,42.97 D2.2
$1N14584: length 5.7
  Top Layer w0.381: U18.3 58.04,52.97 R25.2
$1N14642: length 11.3
  Top Layer w0.254: R53.1 53.32,60.96 55.12,60.96 56.77,59.31 56.77,57.17
  Top Layer w0.381: R24.2 56.77,52.72 56.77,57.17
$1N15295: length 16.2
  Top Layer w0.508: Q2.1 28.45,26.67 26.29,28.83 26.29,32.24 R45.1 27.2,33.89 27.65,34.34 28.23,34.34 28.93,33.64 28.93,33.19 U6.2
$1N15305: length 5.5
  Top Layer w0.508: 30.4,32.91 30.4,31.83 31.12,31.11 32.88,31.11 C18.2
$1N19205: length 4.6
  Top Layer w0.508: SW2.B 20.87,18.11 R30.2 R29.2
$1N19210: length 4.5
  Top Layer w0.508: SW2.A 25.92,16.2 R28.2 R27.1
$1N19642: length 4.5
  Top Layer w0.508: R33.2 R34.2 37.38,18.36 SW3.B
$1N19652: length 4.5
  Top Layer w0.508: SW3.A 42.38,18.36 R32.2 R31.1
$1N21463: length 36.1
  Top Layer w0.762: 40.51,42.29 34.42,36.19 30.73,36.19 29.65,37.28 29.65,37.89 29.49,38.05 29.49,38.18 U6.7 28.77,38.02 28.77,37.39 27.34,35.96 R21.2
  Top Layer w2.032: L2.2 40.85,42.55 R20.1
$1N21716: length 33.6
  Top Layer w0.508: R36.3 53.34,44.66 R35.2 ; U6.5 33.42,40.13 v1(33.53,40.13)
  Bottom Layer w0.508: R36.3 49.62,46.86 36.32,46.86 33.53,44.07 v1(33.53,40.13)
$1N21810: length 2.6
  Top Layer w0.254: C27.2 37.91,55.99 U8.10
$1N23905: length 2.8
  Top Layer w0.254: U12.10 47.05,56.12 C29.2
$1N26107: length 12.8
  Top Layer w0.508: U4.2 60.01,13.53 64.64,8.9 Q1.1 64.75,8.39 R37.2
$1N26297: length 24.9
  Top Layer w1.27: U6.1 27.94,29.97 30.99,26.92
  Top Layer w2.032: L2.1 42.42,31.12 D3.2 32.63,28.57 30.99,26.92 Q2.2
$1N36216: length 3.1
  Top Layer w0.381: R39.1 54.39,71.3 54.39,74.3
$1N36298: length 2.9
  Top Layer w0.381: LED3.1 45.83,73.96 R40.1
$1N65373: length 5.1
  Top Layer w0.381: R51.2 60.58,57.01 U18.5
$1N65377: length 9.5
  Top Layer w0.254: R52.1 64.28,59.69 63.12,59.69 61.85,58.42 61.85,57.17
  Top Layer w0.381: R60.2 R52.1
$1N72576: length 2.7
  Top Layer w0.381: R54.1 2.56,43.64 LED4.1
$1N76167: length 20.4
  Top Layer w0.381: C35.1 14.86,3.41 R55.1
  Top Layer w0.508: R55.1 17.92,4.59 SW2.E
  Bottom Layer w0.381: SW2.E 20.48,2.03 R61.2
$1N76238: length 32.1
  Top Layer w0.508: SW3.E 32.54,1.64 R56.2
  Bottom Layer w0.381: R62.2 23.75,4.06 24.64,3.18 28.32,3.18 30.35,1.14 36.88,1.14 SW3.E 36.6,2.41 C36.1
$1N76827: length 2.6
  Top Layer w0.508: U17.4 16.01,26.11 C32.1

## Copper pours and planes (outline as drawn; the poured copper is in the pictures)
GND on Top Layer: -5.72,84.96 102.62,84.96 102.62,-5.84 -5.72,-5.84
GND on Bottom Layer: -11.43,97.92 106.55,97.92 106.55,-5.46 -11.43,-5.46
PGND on Top Layer: 11.81,43.05 22.1,43.05 23.88,44.83 23.88,45.21 29.44,45.21 29.84,44.82 32.37,44.82 35.05,47.5 42.04,47.5 42.16,47.62 46.86,47.62 47.37,48.13 49.02,48.13 49.66,48.77 53.59,48.77 54.74,47.62 97.37,47.62 99.44,-0.51 46.48,-0.89 46.48,1.4 47.12,2.03 47.12,5.21 48.77,6.86 48.77,17.65 48.9,17.78 48.9,20.32 47.88,21.34 45.97,21.34 43.43,23.88 37.72,23.88 36.07,22.22 27.43,22.22 26.8,22.86 12.19,22.86 11.81,22.48 10.54,22.48 8.64,24.38 8.64,26.8 9.25,27.41 11.56,31.81 11.56,40.25 11.81,40.5

## Text on the board
Bottom Silkscreen Layer: 数控直流电源 / 黄元泽-23211319 / 廖一可-23211326 / 崔以恒-23211288 / 2025/11/23
